# Altium schematic sheet Jade_v1_schematics_PG2_ESP32_SUBSYS.SchDoc
size A4; Author: Hanxiao; Revision: A0_Alpha; SheetNumber: 2; SheetTotal: 4
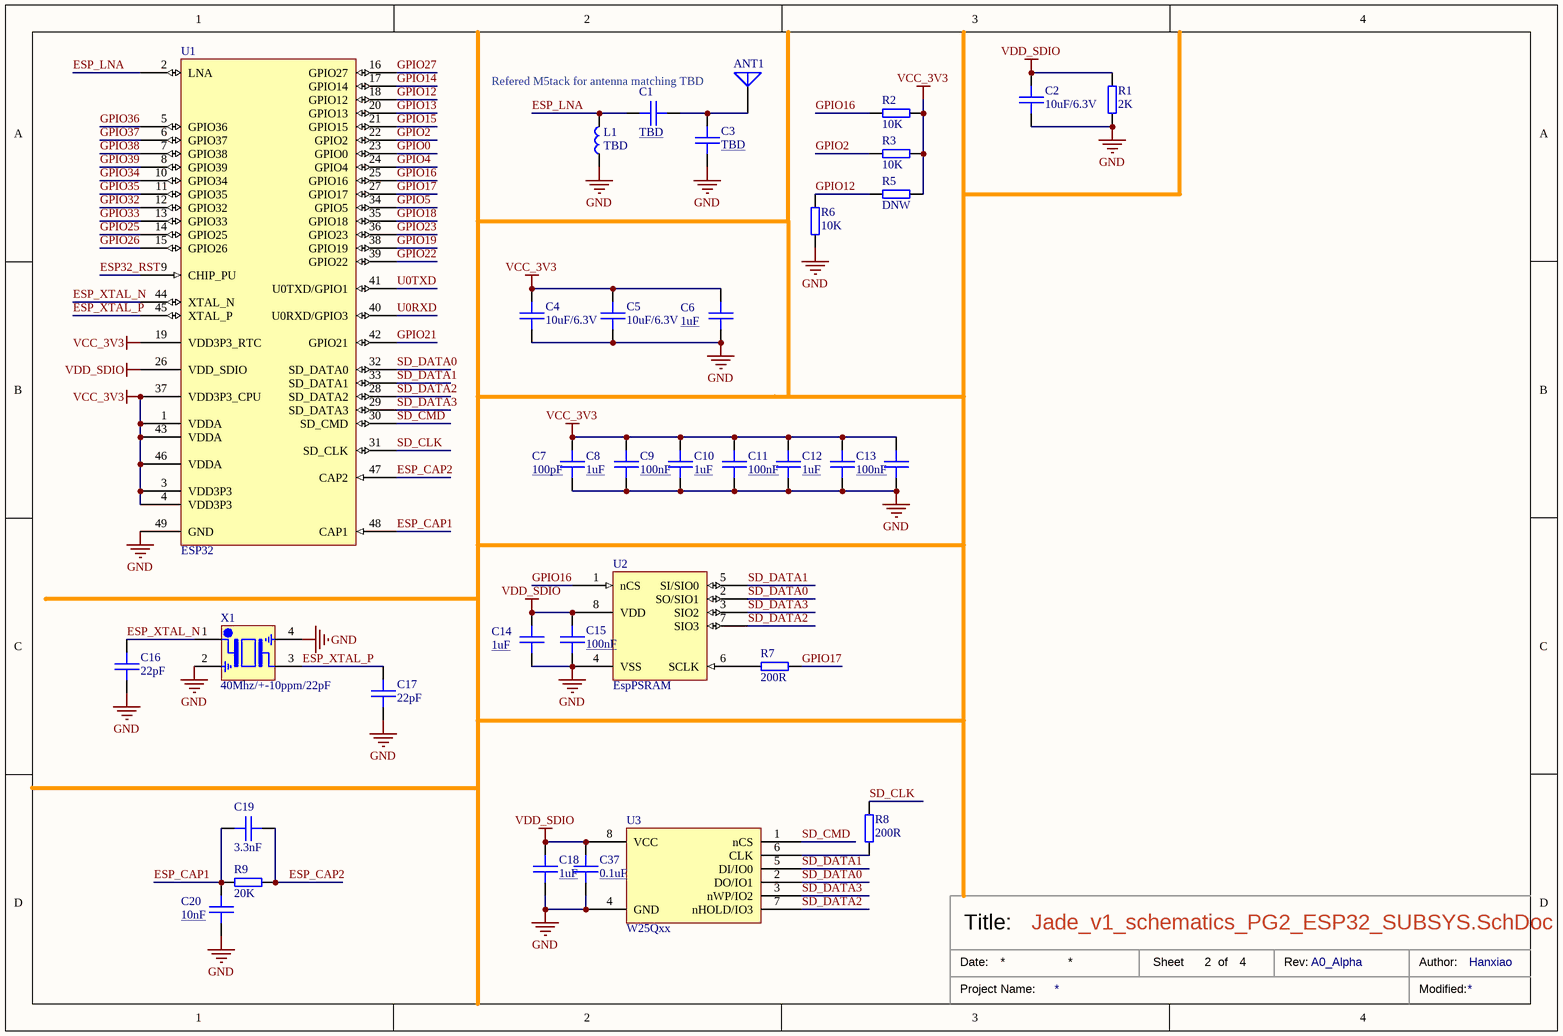
[diagram p0: Jade_v1_schematics_PG2_ESP32_SUBSYS.SchDoc]

## Parts
ANT1  Antenna  [PRO-ANT-440]  (value not drawn)
C1  TBD  [SMT_C_0402]
C2  10uF/6.3V  [SMT_C_0603]
C3  TBD  [SMT_C_0402]
C4  10uF/6.3V  [SMT_C_0603]
C5  10uF/6.3V  [SMT_C_0603]
C6  1uF  [SMT_C_0402]
C7  100pF  [SMT_C_0402]
C8  1uF  [SMT_C_0402]
C9  100nF  [SMT_C_0402]
C10  1uF  [SMT_C_0402]
C11  100nF  [SMT_C_0402]
C12  1uF  [SMT_C_0402]
C13  100nF  [SMT_C_0402]
C14  1uF  [SMT_C_0402]
C15  100nF  [SMT_C_0402]
C16  22pF  [SMT_C_0402]
C17  22pF  [SMT_C_0402]
C18  1uF  [SMT_C_0402]
C19  3.3nF  [SMT_C_0402]
C20  10nF  [SMT_C_0402]
C37  0.1uF  [SMT_C_0402]
L1  TBD  [SMT_L_0402]
R1  2K  [SMT_R_0402]
R2  10K  [SMT_R_0402]
R3  10K  [SMT_R_0402]
R5  DNW  [SMT_R_0402]
R6  10K  [SMT_R_0402]
R7  200R  [SMT_R_0402]
R8  200R  [SMT_R_0402]
R9  20K  [SMT_R_0402]
U1  ESP32  [PQFN40P600X600X90_HS-49N]
U2  EspPSRAM  [SOP-8]
U3  W25Qxx  [WSOP-8]
X1  40Mhz/+-10ppm/22pF  [SMT_XTAL_2520]

## Nets
GND: C2.2 C3.1 C4.2 C5.2 C6.1 C7.1 C8.1 C9.1 C10.1 C11.1 C12.1 C13.1 C14.1 C15.1 C16.2 C17.2 C18.2 C20.1 C37.1 L1.2 R1.1 R6.1 U1.49(GND) U2.4(VSS) U3.4(GND) X1.2(GND) X1.4(GND)
VCC_3V3: C4.1 C5.1 C6.2 C7.2 C8.2 C9.2 C10.2 C11.2 C12.2 C13.2 R2.2 R3.2 R5.2 U1.1(VDDA) U1.3(VDD3P3) U1.4(VDD3P3) U1.19(VDD3P3_RTC) U1.37(VDD3P3_CPU) U1.43(VDDA) U1.46(VDDA)
VDD_SDIO: C2.1 C14.2 C15.2 C18.1 C37.2 R1.2 U1.26(VDD_SDIO) U2.8(VDD) U3.8(VCC)
ESP32_RST: U1.9(CHIP_PU)
ESP_CAP1: C19.1 C20.2 R9.1 U1.48(CAP1)
ESP_CAP2: C19.2 R9.2 U1.47(CAP2)
ESP_LNA: C1.1 L1.1 U1.2(LNA)
ESP_XTAL_N: C16.1 U1.44(XTAL_N) X1.1(IN/OUT)
ESP_XTAL_P: C17.1 U1.45(XTAL_P) X1.3(IN/OUT)
GPIO0: U1.23(GPIO0)
GPIO2: R3.1 U1.22(GPIO2)
GPIO4: U1.24(GPIO4)
GPIO5: U1.34(GPIO5)
GPIO12: R5.1 R6.2 U1.18(GPIO12)
GPIO13: U1.20(GPIO13)
GPIO14: U1.17(GPIO14)
GPIO15: U1.21(GPIO15)
GPIO16: R2.1 U1.25(GPIO16) U2.1(nCS)
GPIO17: R7.1 U1.27(GPIO17)
GPIO18: U1.35(GPIO18)
GPIO19: U1.38(GPIO19)
GPIO21: U1.42(GPIO21)
GPIO22: U1.39(GPIO22)
GPIO23: U1.36(GPIO23)
GPIO25: U1.14(GPIO25)
GPIO26: U1.15(GPIO26)
GPIO27: U1.16(GPIO27)
GPIO32: U1.12(GPIO32)
GPIO33: U1.13(GPIO33)
GPIO34: U1.10(GPIO34)
GPIO35: U1.11(GPIO35)
GPIO36: U1.5(GPIO36)
GPIO37: U1.6(GPIO37)
GPIO38: U1.7(GPIO38)
GPIO39: U1.8(GPIO39)
SD_CLK: R8.1 U1.31(SD_CLK)
SD_CMD: U1.30(SD_CMD) U3.1(nCS)
SD_DATA0: U1.32(SD_DATA0) U2.2(SO/SIO1) U3.2(DO/IO1)
SD_DATA1: U1.33(SD_DATA1) U2.5(SI/SIO0) U3.5(DI/IO0)
SD_DATA2: U1.28(SD_DATA2) U2.7(SIO3) U3.7(nHOLD/IO3)
SD_DATA3: U1.29(SD_DATA3) U2.3(SIO2) U3.3(nWP/IO2)
U0RXD: U1.40(U0RXD/GPIO3)
U0TXD: U1.41(U0TXD/GPIO1)
NetANT1_1: ANT1.1(A) C1.2 C3.2
NetR7_2: R7.2 U2.6(SCLK)
NetR8_2: R8.2 U3.6(CLK)

## Notes on the sheet
- Refered M5tack for antenna matching TBD
- Date:
- Title:
- Sheet
- of
- Rev:
- Author:
- Project Name:
- Modified:

## Library data of the parts
ANT1 = Antenna: Generic Antenna
C1 C3 C6-C20 C37 = SMT_C_0402: Surface mount capacitor 0402
C2 C4 C5 = SMT_C_0603: Surface mount capacitor 0603
L1 = SMT_L_0402: Surface mount inductor 0402
R1-R3 R5-R9 = SMT_R_0402: Surface mount resistor 0402
U1 = ESP32: ESP32 is designed for mobile, wearable electronics, and Internet of Things (IoT) applications. It has many features  of the state-of-the-art low power chips, including fine resolution clock gating, power modes, and dynamic power  scaling.
U3 = W25QXX: Serial flash memory with dual and quad SPI
X1 = SMT_XTAL_PASSIVE: Passive crystal